# Altium schematic sheet TopSheet.schdoc: Top Sheet
size A4; Organization1: Sciences of Technology Buchs; Size: A4
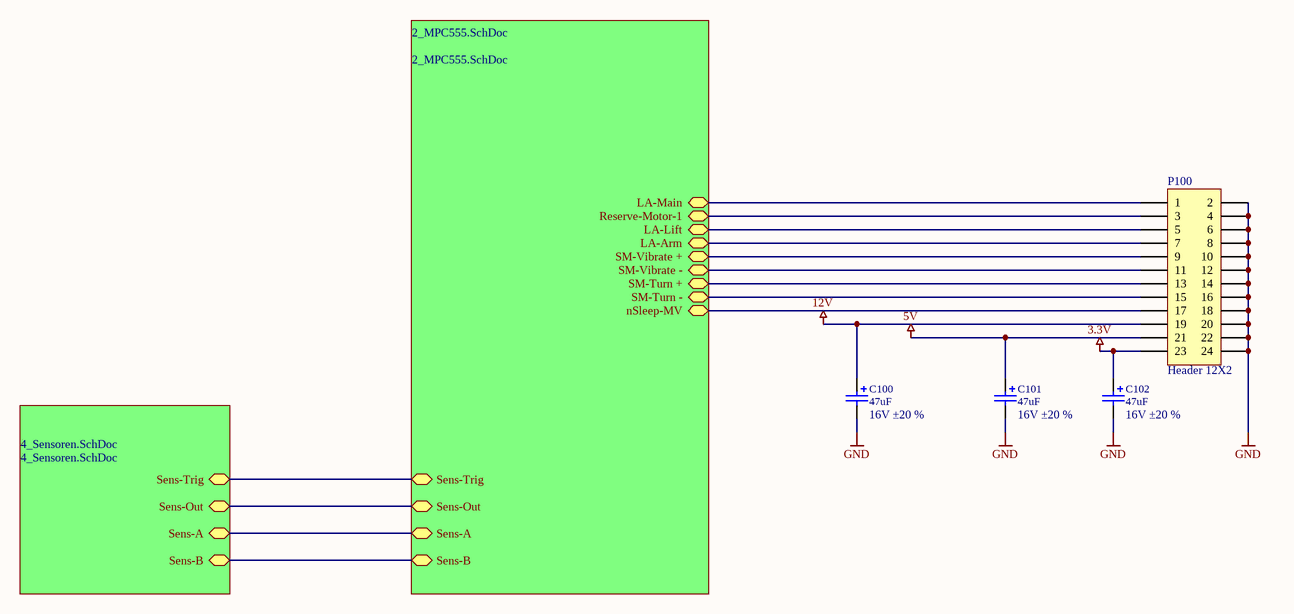
[diagram p0: TopSheet.schdoc]

## Parts
C100  value 47uF  ValueAddon: 16V ±20 %  [CDE_CAP AVE CODE D_H]  (hidden comment: AVE476M16D16T-F)
C101  value 47uF  ValueAddon: 16V ±20 %  [CDE_CAP AVE CODE D_H]  (hidden comment: AVE476M16D16T-F)
C102  value 47uF  ValueAddon: 16V ±20 %  [CDE_CAP AVE CODE D_H]  (hidden comment: AVE476M16D16T-F)
P100  Header 12X2  [HDR2X12]

## Sub-sheets
2_MPC555.SchDoc = 2_MPC555.SchDoc: Sens-Trig, Sens-Out, Sens-A, Sens-B, LA-Main, Reserve-Motor-1, LA-Lift, LA-Arm, SM-Vibrate +, SM-Vibrate -, SM-Turn +, SM-Turn -, nSleep-MV
4_Sensoren.SchDoc = 4_Sensoren.SchDoc: Sens-Trig, Sens-Out, Sens-A, Sens-B

## Nets
3.3V: C102.1(Pos) P100.23
5V: C101.1(Pos) P100.21
12V: C100.1(Pos) P100.19
GND: C100.2(Neg) C101.2(Neg) C102.2(Neg) P100.2 P100.4 P100.6 P100.8 P100.10 P100.12 P100.14 P100.16 P100.18 P100.20 P100.22 P100.24
NetP100_1: P100.1 ; sheet 2_MPC555.SchDoc/LA-Main
NetP100_3: P100.3 ; sheet 2_MPC555.SchDoc/Reserve-Motor-1
NetP100_5: P100.5 ; sheet 2_MPC555.SchDoc/LA-Lift
NetP100_7: P100.7 ; sheet 2_MPC555.SchDoc/LA-Arm
NetP100_9: P100.9 ; sheet 2_MPC555.SchDoc/SM-Vibrate +
NetP100_11: P100.11 ; sheet 2_MPC555.SchDoc/SM-Vibrate -
NetP100_13: P100.13 ; sheet 2_MPC555.SchDoc/SM-Turn +
NetP100_15: P100.15 ; sheet 2_MPC555.SchDoc/SM-Turn -
NetP100_17: P100.17 ; sheet 2_MPC555.SchDoc/nSleep-MV
(unnamed): sheet 2_MPC555.SchDoc/Sens-Trig, sheet 4_Sensoren.SchDoc/Sens-Trig
(unnamed): sheet 2_MPC555.SchDoc/Sens-Out, sheet 4_Sensoren.SchDoc/Sens-Out
(unnamed): sheet 2_MPC555.SchDoc/Sens-A, sheet 4_Sensoren.SchDoc/Sens-A
(unnamed): sheet 2_MPC555.SchDoc/Sens-B, sheet 4_Sensoren.SchDoc/Sens-B

## Notes on the sheet
- Title:
- Description:
- Size:
- Date:
- Name:
- Number:
- Time:
- Revision:
- Sheet
- Checked:
- of
- File:

## Library data of the parts
C100-C102 = ELKO 47uF 16V: ELKO, 47uF, 16V, CDE_AVE476M16D16T-F_AVE CODE D; Manufacturer: Cornell Dubilier; #Class: PASSIVE; #ClassSub: CAPACITOR; RefFootprint: CDE_CAP AVE CODE D; Distributor PartNr: 598-AVE476M16D16T-F; Distributor: Mouser; Published: 20121220; Publisher: Stefan Ursella, M.Eng; ComponentLink1Description: Manufacturer Link; ComponentLink2Description: Datasheet; ComponentLink2URL: http://www.cde.com/catalogs/AVE.pdf; ComponentLink3Description: Packaging Specification; Manufacturer PartNr: AVE476M16D16T-F; RefFileFOO: *; RefFileSCH: *; RefSchema: CDE_AVE476M16D16T-F_AVE CODE D; ClassName: Connect_Full
P100 = Header 12X2: Header, 12-Pin, Dual row; LatestRevisionDate: 17-Jul-2002; LatestRevisionNote: Re-released for DXP Platform.; Publisher: Altium Limited